# Altium schematic sheet Machnguon.SchDoc
size A4; SheetNumber: 2; SheetTotal: 2
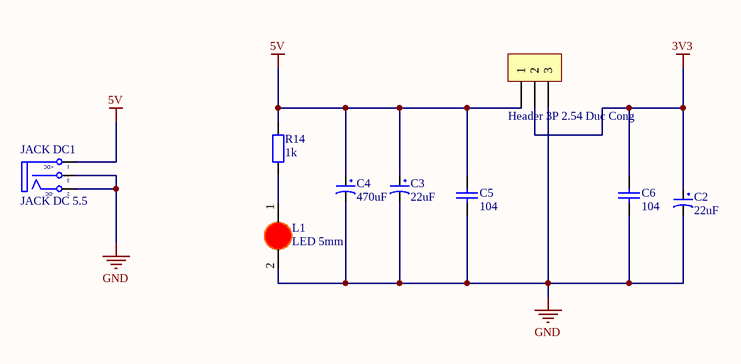
[diagram p0: Machnguon.SchDoc]

## Parts
C2  22uF  [tu hoa 5mm]
C3  22uF  [tu hoa 5mm]
C4  470uF  [tu hoa 8mm]
C5  104  [tu gom]
C6  104  [tu gom]
H14  Header 3P 2.54 Duc Cong  [Header 3P DC 2.54]
JACK_DC1  JACK DC 5.5  [JACK DC 5.5]
L1  LED 5mm  [LED-5MM-RED]
R14  1k  [tro vach 1/4w]

## Nets
3V3: C2.1 C6.1 H14.2
5V: C3.1 C4.1 C5.1 H14.1 JACK_DC1.1(T) R14.2
GND: C2.2 C3.2 C4.2 C5.2 C6.2 H14.3 JACK_DC1.2(TN) JACK_DC1.3(S) L1.2(K)
NetL1_1: L1.1(A) R14.1

## Notes on the sheet
- (in symbol JACK DC 5.5) +DC; -DC

## Library data of the parts
C2 C3 = Tu Hoa 22uF 35V 5x11: Cắm; Don_Vi: Con; So_Chan: 2; Ten_Linh_Kien: Tụ Hóa 22uF 35V 5x11MM; Ma_Hang: MH001350; Chung_Loai: Cắm; Kieu_Chan: *
C4 = Tu Hoa 470uF 16V 8x11: Cắm; Don_Vi: Con; So_Chan: 2; Ten_Linh_Kien: Tụ Hóa 470uF 16V 8x11MM; Ma_Hang: MH006550; Chung_Loai: Cắm; Kieu_Chan: *
C5 C6 = Tu gom 104 50V: Cắm; So_Chan: 2; Ten_Linh_Kien: Tụ gốm 104 100nF 50V; Don_Vi: Con; Ma_Hang: MH004761; Chung_Loai: Cắm; Kieu_Chan: *
H14 = Header 3P 2.54 Duc Cong: Cắm; Ten_Linh_Kien: Header 3P XH2.54-3P Đực Cong; Don_Vi: Con; Ma_Hang: MH001302; Chung_Loai: Cắm
JACK_DC1 = JACK DC 5.5: Value: Jac DC
L1 = LED 5mm Do: Cắm; Don_Vi: Con; Ma_Hang: MH008967; Ten_Linh_Kien: Led 5MM Phủ Đỏ (1000c); Ghi_Chu: *; Kieu_Chan: *; Chung_Loai: Cắm
R14 = Tro Vach 1/4W 5% 1k: Cắm; Don_Vi: Con; So_Chan: 2; Ten_Linh_Kien: Trở Vạch 1/4w 5% 1k; Ma_Hang: MH007390; Chung_Loai: Cắm; Kieu_Chan: *